# Altium schematic sheet Sheet1.SchDoc
size A; SheetNumber: 1; SheetTotal: 1
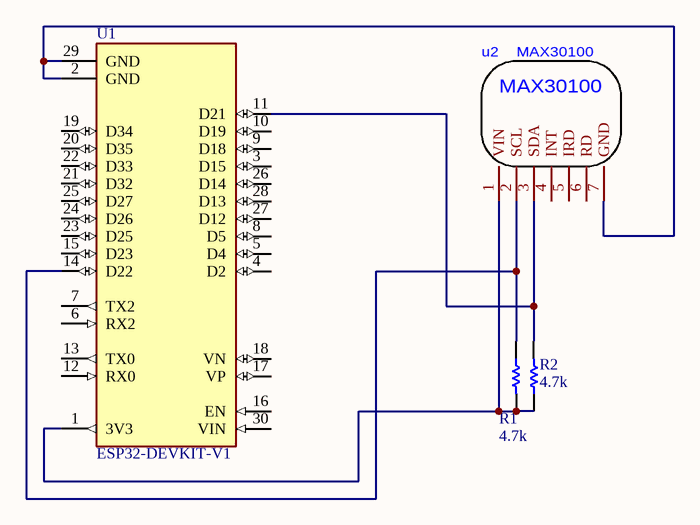
[diagram p0: Sheet1.SchDoc]

## Parts
R1  value 4.7k  [R1/4W]  (hidden comment: Res1)
R2  value 4.7k  [R1/4W]  (hidden comment: Res1)
U1  ESP32-DEVKIT-V1  [MODULE_ESP32_DEVKIT_V1]
u2  MAX30100  [MAX30100_MODULE]

## Nets
NetR1_1: R1.1 U1.14(D22) u2.2(SCL)
NetR1_2: R1.2 R2.1 U1.1(3V3) u2.1(VIN)
NetR2_2: R2.2 U1.11(D21) u2.3(SDA)
NetU1_2: U1.2(GND) U1.29(GND) u2.7(GND)

Not connected (* = marked no-connect by the designer): U1 3(D15) 4(D2) 5(D4) 6(RX2) 7(TX2) 8(D5) 9(D18) 10(D19) 12(RX0) 13(TX0) 15(D23) 16(EN) 17(VP) 18(VN) 19(D34) 20(D35) 21(D32) 22(D33) 23(D25) 24(D26) 25(D27) 26(D14) 27(D12) 28(D13) 30(VIN); u2 4(INT) 5(IRD) 6(RD)

## Library data of the parts
R1 R2 = Res1_1: Resistor; Manufacturer: Generic Components; Class: Passive; Published: 08/06/2000; Publisher: Altium Hobart Technology Centre; SubClass: Resistor
U1 = ESP32-DEVKIT-V1: Dual core, Wi-Fi: 2.4 GHz up to 150 Mbits/s,BLE (Bluetooth Low Energy) and legacy Bluetooth, 32 bits, Up to 240 MHz; MF: Do it; Price: None; Availability: Not in stock; Package: None; MP: ESP32-DEVKIT-V1; Value: *; SnapEDA_Link: https://www.snapeda.com/parts/ESP32-DEVKIT-V1/Do+it/view-part/?ref=snap; Check_prices: https://www.snapeda.com/parts/ESP32-DEVKIT-V1/Do+it/view-part/?ref=eda
u2 = MAX30100 MODULE COPY